# EasyEDA Pro project dspbv3_pcb.epro

# Board PCB1
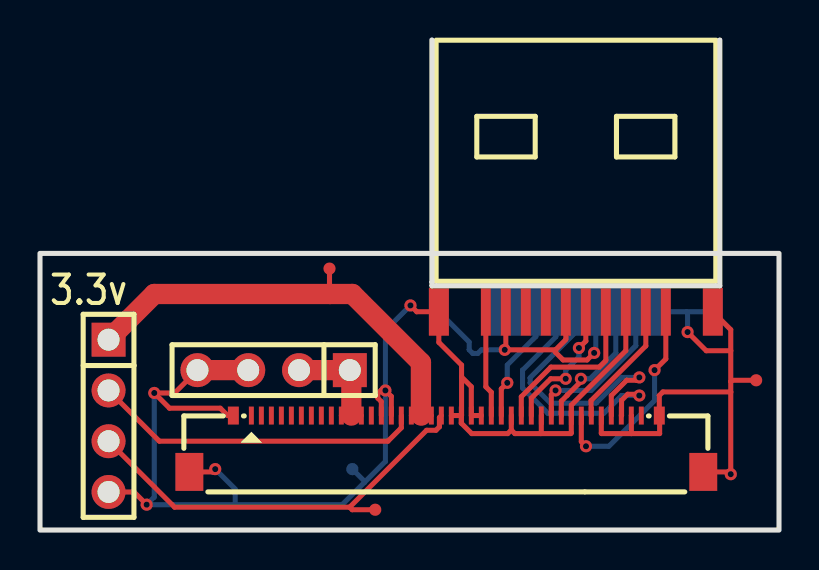
[diagram p0: board, top side]
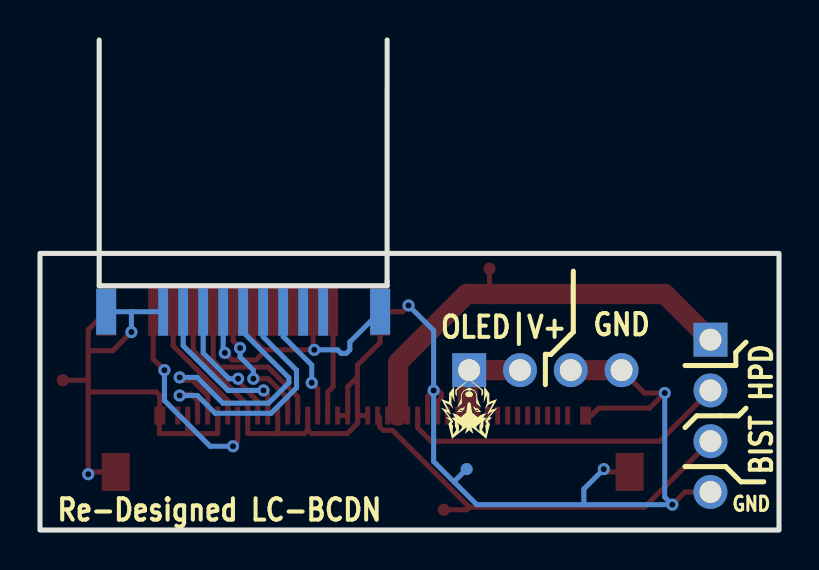
[diagram p1: board, bottom side, seen from below]

Outline 36.96 x 24.52 mm; copper layers: Top Layer, Bottom Layer. Coordinates in mm from the lower left corner of the outline.
Outline path: rectangle 0,13.84 36.96,0
Stack: Top Layer 0.035mm / Dielectric1 1.51mm FR4 er 4.5 / Bottom Layer 0.035mm

## Design rules (mm)
template: JLCPCB Capability(Two Layers Board)
spacing copperThickness1oz (default): track to track 0.102, other pairs 0.152 to 0.3
spacing copperThickness2oz: track to track 0.203, other pairs 0.152 to 0.3
track width copperThickness1oz (default): min 0.127, default 0.254, max 2.54
track width copperThickness2oz: min 0.203, default 0.254, max 2.54
differential pair differentialPair (default): width min 0.127, default 0.254, max 2.54; gap min 0.152, default 0.152
via viaSize (default): diameter min 0.5, default 0.61, max 10; hole min 0.3, default 0.305, max 6.3

## Placement (name value [footprint] x y rotation side)
CN1  20455-040E-76  [CONN-SMD_40P-P-0.50_20455-040E-76]  20.32 4.32 0 top
CN2  HYC109-HDMIA19-160  [HDMI-SMD_HYC109-HDMIA19-160]  26.8 10.92 180 top
H1  PZ254V-11-04P  [HDR-TH_4P-P2.54-V-M]  11.68 8 180 top
H2  PZ254V-11-04P  [HDR-TH_4P-P2.54-V-M]  3.43 5.72 270 top
NOREF  -  [Pad_e739]  35.81 7.49 0 top
NOREF#2  -  [Pad_e557]  15.62 3.05 0 top
NOREF#3  -  [Pad_e748]  16.76 1.02 0 top
NOREF#4  -  [Pad_e545]  14.48 13.08 0 top

## Footprints (pads in the part's own frame, mm; a bottom-side part is the same pattern mirrored in y, then rotated)
CONN-SMD_40P-P-0.50_20455-040E-76
  rect 0.25x0.9 smd: 1(-9.75,1.41) 2(-9.25,1.41) 3(-8.75,1.41) 4(-8.25,1.41) 5(-7.75,1.41) 6(-7.25,1.41) 7(-6.75,1.41) 8(-6.25,1.41) 9(-5.75,1.41) 10(-5.25,1.41) 11(-4.75,1.41) 12(-4.25,1.41) 13(-3.75,1.41) 14(-3.25,1.41) 15(-2.75,1.41) 16(-2.25,1.41) 17(-1.75,1.41) 18(-1.25,1.41) 19(-0.75,1.41) 20(-0.25,1.41) 21(0.25,1.41) 22(0.75,1.41) 23(1.25,1.41) 24(1.75,1.41) 25(2.25,1.41) 26(2.75,1.41) 27(3.25,1.41) 28(3.75,1.41) 29(4.25,1.41) 30(4.75,1.41) 31(5.25,1.41) 32(5.75,1.41) 33(6.25,1.41) 34(6.75,1.41) 35(7.25,1.41) 36(7.75,1.41) 37(8.25,1.41) 38(8.75,1.41) 39(9.25,1.41) 40(9.75,1.41)
  rect 0.55x0.9 smd: 41(10.65,1.41) 42(-10.65,1.41)
  rect 1.4x1.9 smd: 43(-12.85,-1.41) 44(12.85,-1.41)
HDMI-SMD_HYC109-HDMIA19-160
  rect 0.5x2.4 smd: 1(-4.5,0) 3(-3.5,0) 5(-2.5,0) 7(-1.5,0) 9(-0.5,0) 11(0.5,0) 13(1.5,0) 15(2.5,0) 17(3.5,0) 19(4.5,0)
  rect 0.5x2.4 smd far side: 2(-4,0) 4(-3,0) 6(-2,0) 8(-1,0) 10(0,0) 12(1,0) 14(2,0) 16(3,0) 18(4,0)
  rect 1x2.4 smd: 20(-6.85,0) 21(6.85,0)
  rect 1x2.3 smd far side: 22(-6.85,0) 23(6.85,0)
HDR-TH_4P-P2.54-V-M
  rect 1.7x1.7 hole 1.1: 1(-3.81,0)
  round 1.7 hole 1.1: 2(-1.27,0) 3(1.27,0) 4(3.81,0)
Pad_e545
  round 0.61 smd: TP1(0,0)
Pad_e557
  round 0.61 smd far side: TP4(0,0)
Pad_e739
  round 0.61 smd: TP5(0,0)
Pad_e748
  round 0.61 smd: TP6(0,0)

## Nets
+3.3V: CN1.17 CN1.18 CN1.19 H2.1 NOREF#4.TP1
+5V: CN2.18
GND: CN1.14 CN1.15 CN1.21 CN1.22 CN1.23 CN1.24 CN1.27 CN1.30 CN1.33 CN1.36 CN1.39 CN1.41 CN1.42 CN1.43 CN1.44 CN2.2 CN2.5 CN2.8 CN2.11 CN2.17 CN2.20 CN2.21 CN2.22 CN2.23 H1.3 H1.4 H2.4 NOREF.TP5 NOREF#2.TP4
AUXN: CN1.25 CN2.19
AUXP: CN1.26 CN2.14
BIST_EN: CN1.20 H2.3 NOREF#3.TP6
CKN: CN1.38 CN2.12
CKP: CN1.37 CN2.10
D0N: CN1.29 CN2.9
D0P: CN1.28 CN2.7
D1N: CN1.32 CN2.6
D1P: CN1.31 CN2.4
D2N: CN1.35 CN2.3
D2P: CN1.34 CN2.1
HPD: CN1.16 H2.2
$1N962: CN1.10 CN1.11 CN1.12 H1.1 H1.2

Pads without a net: CN1 1 2 3 4 5 6 7 8 9 13 40; CN2 13 15 16

## Via types
v1: diameter 0.61, hole 0.305, Top Layer to Bottom Layer, 18 vias

## Routing (per net, layer and track width the routed paths; a pad name or vN(x,y) marks a point on that pad's centre or on a via; arc(x,y) is an arc through that point)
+3.3V: length 22.9
  Top Layer w0.254: CN1.17 CN1.18 CN1.19 ; 14.5,11.81 14.48,11.84 NOREF#4.TP1
  Top Layer w1.016: H2.1 5.71,11.81 15.62,11.81 19.05,8.38 19.05,5.75 CN1.18
GND: length 115
  Top Layer w0.254: 34.54,7.43 34.6,7.49 NOREF.TP5 ; 34.54,7.43 34.54,6.9 ; 34.54,7.43 34.54,8.97 ; 33.17,2.91 34.43,2.91 v1(34.54,2.79) 34.54,6.9 ; 25.04,4.83 26.54,4.83 26.57,4.85 CN1.33 26.57,6.25 29.3,8.98 CN2.5 ; 25.04,4.83 23.75,4.83 23.57,5.01 ; 25.04,4.83 25.07,4.85 CN1.30 ; CN1.24 CN1.23 21.57,7.17 21.08,7.66 ; 23.57,5.01 CN1.27 ; 23.57,5.01 23.39,4.83 21.59,4.83 21.07,5.35 CN1.22 ; 21.08,7.66 21.08,8.26 19.95,9.39 CN2.21 18.84,10.92 v1(18.53,11.24) ; 21.08,7.66 21.08,5.74 CN1.22 ; CN1.15 17.57,6.69 v1(17.27,6.98) 17.05,6.98 16.89,6.83 16.89,6.6 17.07,6.43 CN1.14 ; CN2.20 34.54,10.03 34.54,8.97 ; 34.54,6.9 34.53,6.91 31.15,6.91 30.97,6.73 CN1.41 30.99,5.71 30.99,4.83 29.57,4.83 ; 34.54,8.97 33.32,8.97 v1(32.38,9.91) ; 29.57,4.83 28.09,4.83 28.07,4.84 CN1.36 ; 29.57,4.83 29.57,5.73 CN1.39 ; 7.47,2.91 8.62,2.91 v1(8.76,3.05) ; H2.4 4.7,1.91 v1(5.33,1.27) ; CN1.21 CN1.22 ; CN2.11 26.3,9.53 25.78,9.02 ; CN1.42 9.38,5.73 9.02,6.1 6.48,6.1 v1(5.71,6.86) 6.73,6.86 H1.4 ; 25.78,9.02 v1(23.24,9.02) 23.3,9.07 CN2.17 ; 25.78,9.02 25.78,8.89 26.16,8.51 27.36,8.51 v1(27.71,8.86)
  Top Layer w1.016: H1.3 H1.4
  Bottom Layer w0.254: 9.76,1.27 15.11,1.27 16.23,2.39 ; 9.76,1.27 v1(5.33,1.27) 5.71,1.65 v1(5.71,6.86) ; 9.76,1.27 9.76,2.05 v1(8.76,3.05) ; NOREF#2.TP4 16.23,2.44 16.23,2.39 ; v1(18.53,11.24) 17.27,9.98 v1(17.27,6.98) 17.27,3.43 16.23,2.39 ; CN2.8 27.8,8.95 v1(27.71,8.86) ; v1(32.38,9.91) 32.38,10.87 32.34,10.92 ; v1(23.24,9.02) 22.08,9.02 21.9,8.84 21.64,8.84 21.46,9.02 21.46,9.41 CN2.21 ; CN2.2 32.34,10.92 ; 32.34,10.92 CN2.20
AUXN: length 5.3
  Top Layer w0.254: CN2.19 22.3,7.17 22.57,6.89 CN1.25
AUXP: length 5.9
  Top Layer w0.254: CN1.26 23.07,7.07 v1(23.37,7.37)
  Bottom Layer w0.254: CN2.14 24.8,9.68 23.37,8.26 v1(23.37,7.37)
BIST_EN: length 21.5
  Top Layer w0.254: 15.48,1.14 15.61,1.02 NOREF#3.TP6 ; 15.48,1.14 6.73,1.14 H2.3 ; 15.48,1.14 19.33,4.99 19.8,4.99 19.97,5.16 19.97,5.63 CN1.20
CKN: length 13
  Top Layer w0.254: v1(29.97,6.73) 29.91,6.79 29.39,6.79 29.08,6.49 29.08,5.74 CN1.38
  Bottom Layer w0.254: v1(29.97,6.73) 29.08,6.73 28.19,5.84 25.4,5.84 24.13,7.11 24.13,8 25.8,9.67 CN2.12
CKP: length 13.7
  Top Layer w0.254: CN1.37 28.57,6.73 29.34,7.49 29.83,7.49 v1(29.97,7.64)
  Bottom Layer w0.254: CN2.10 26.8,9.91 24.51,7.62 24.51,7.37 25.53,6.35 27.81,6.35 29.1,7.64 v1(29.97,7.64)
D0N: length 6.8
  Top Layer w0.254: CN1.29 24.57,6.6 25.54,7.57 v1(26.29,7.57) ; v1(26.95,9.11) 27.3,9.46 CN2.9
  Bottom Layer w0.254: v1(26.95,9.11) 26.95,8.66 26.29,8 v1(26.29,7.57)
D0P: length 8.4
  Top Layer w0.254: CN2.7 28.3,8.48 27.96,8.15 25.55,8.15 24.07,6.67 CN1.28
D1N: length 6.6
  Top Layer w0.254: v1(27.05,7.57) 27.05,7.43 26.36,6.75 26.36,6.74 26.07,6.45 CN1.32
  Bottom Layer w0.254: v1(27.05,7.57) 27.51,7.57 28.8,8.86 CN2.6
D1P: length 8
  Top Layer w0.254: CN1.31 25.57,6.77 v1(25.78,6.98)
  Bottom Layer w0.254: CN2.4 29.8,9.22 27.56,6.98 v1(25.78,6.98)
D2N: length 6.3
  Top Layer w0.254: CN1.35 27.56,5.74 27.56,6.48 30.3,9.22 CN2.3
D2P: length 10.7
  Top Layer w0.254: CN2.1 31.3,8.56 v1(30.73,8) ; v1(27.3,4.19) 27.07,4.43 CN1.34
  Bottom Layer w0.254: v1(30.73,8) 30.73,6.48 28.45,4.19 v1(27.3,4.19)
HPD: length 16.6
  Top Layer w0.254: CN1.16 18.07,5.12 17.4,4.45 5.97,4.45 H2.2
$1N962: length 5.8
  Top Layer w0.254: CN1.12 CN1.11 CN1.10
  Top Layer w1.016: CN1.11 15.57,7.93 H1.1 H1.2

## Text on the board
Bottom Silkscreen Layer: GND | HPD | BIST | OLED|V+ | Re-Designed LC-BCDN
Top Silkscreen Layer: 3.3v
